# EasyEDA Pro project FM解调rda5807.eprj

# Schematic Schematic1
Board Name: Board1; Create Date: 2025-06-25; Page Name: P1; Project Name: NE564FM解调; Schematic Name: Schematic1; Update Date: 2025-07-04; Company: 嘉立创EDA; Page Size: A4; Version: V1.0
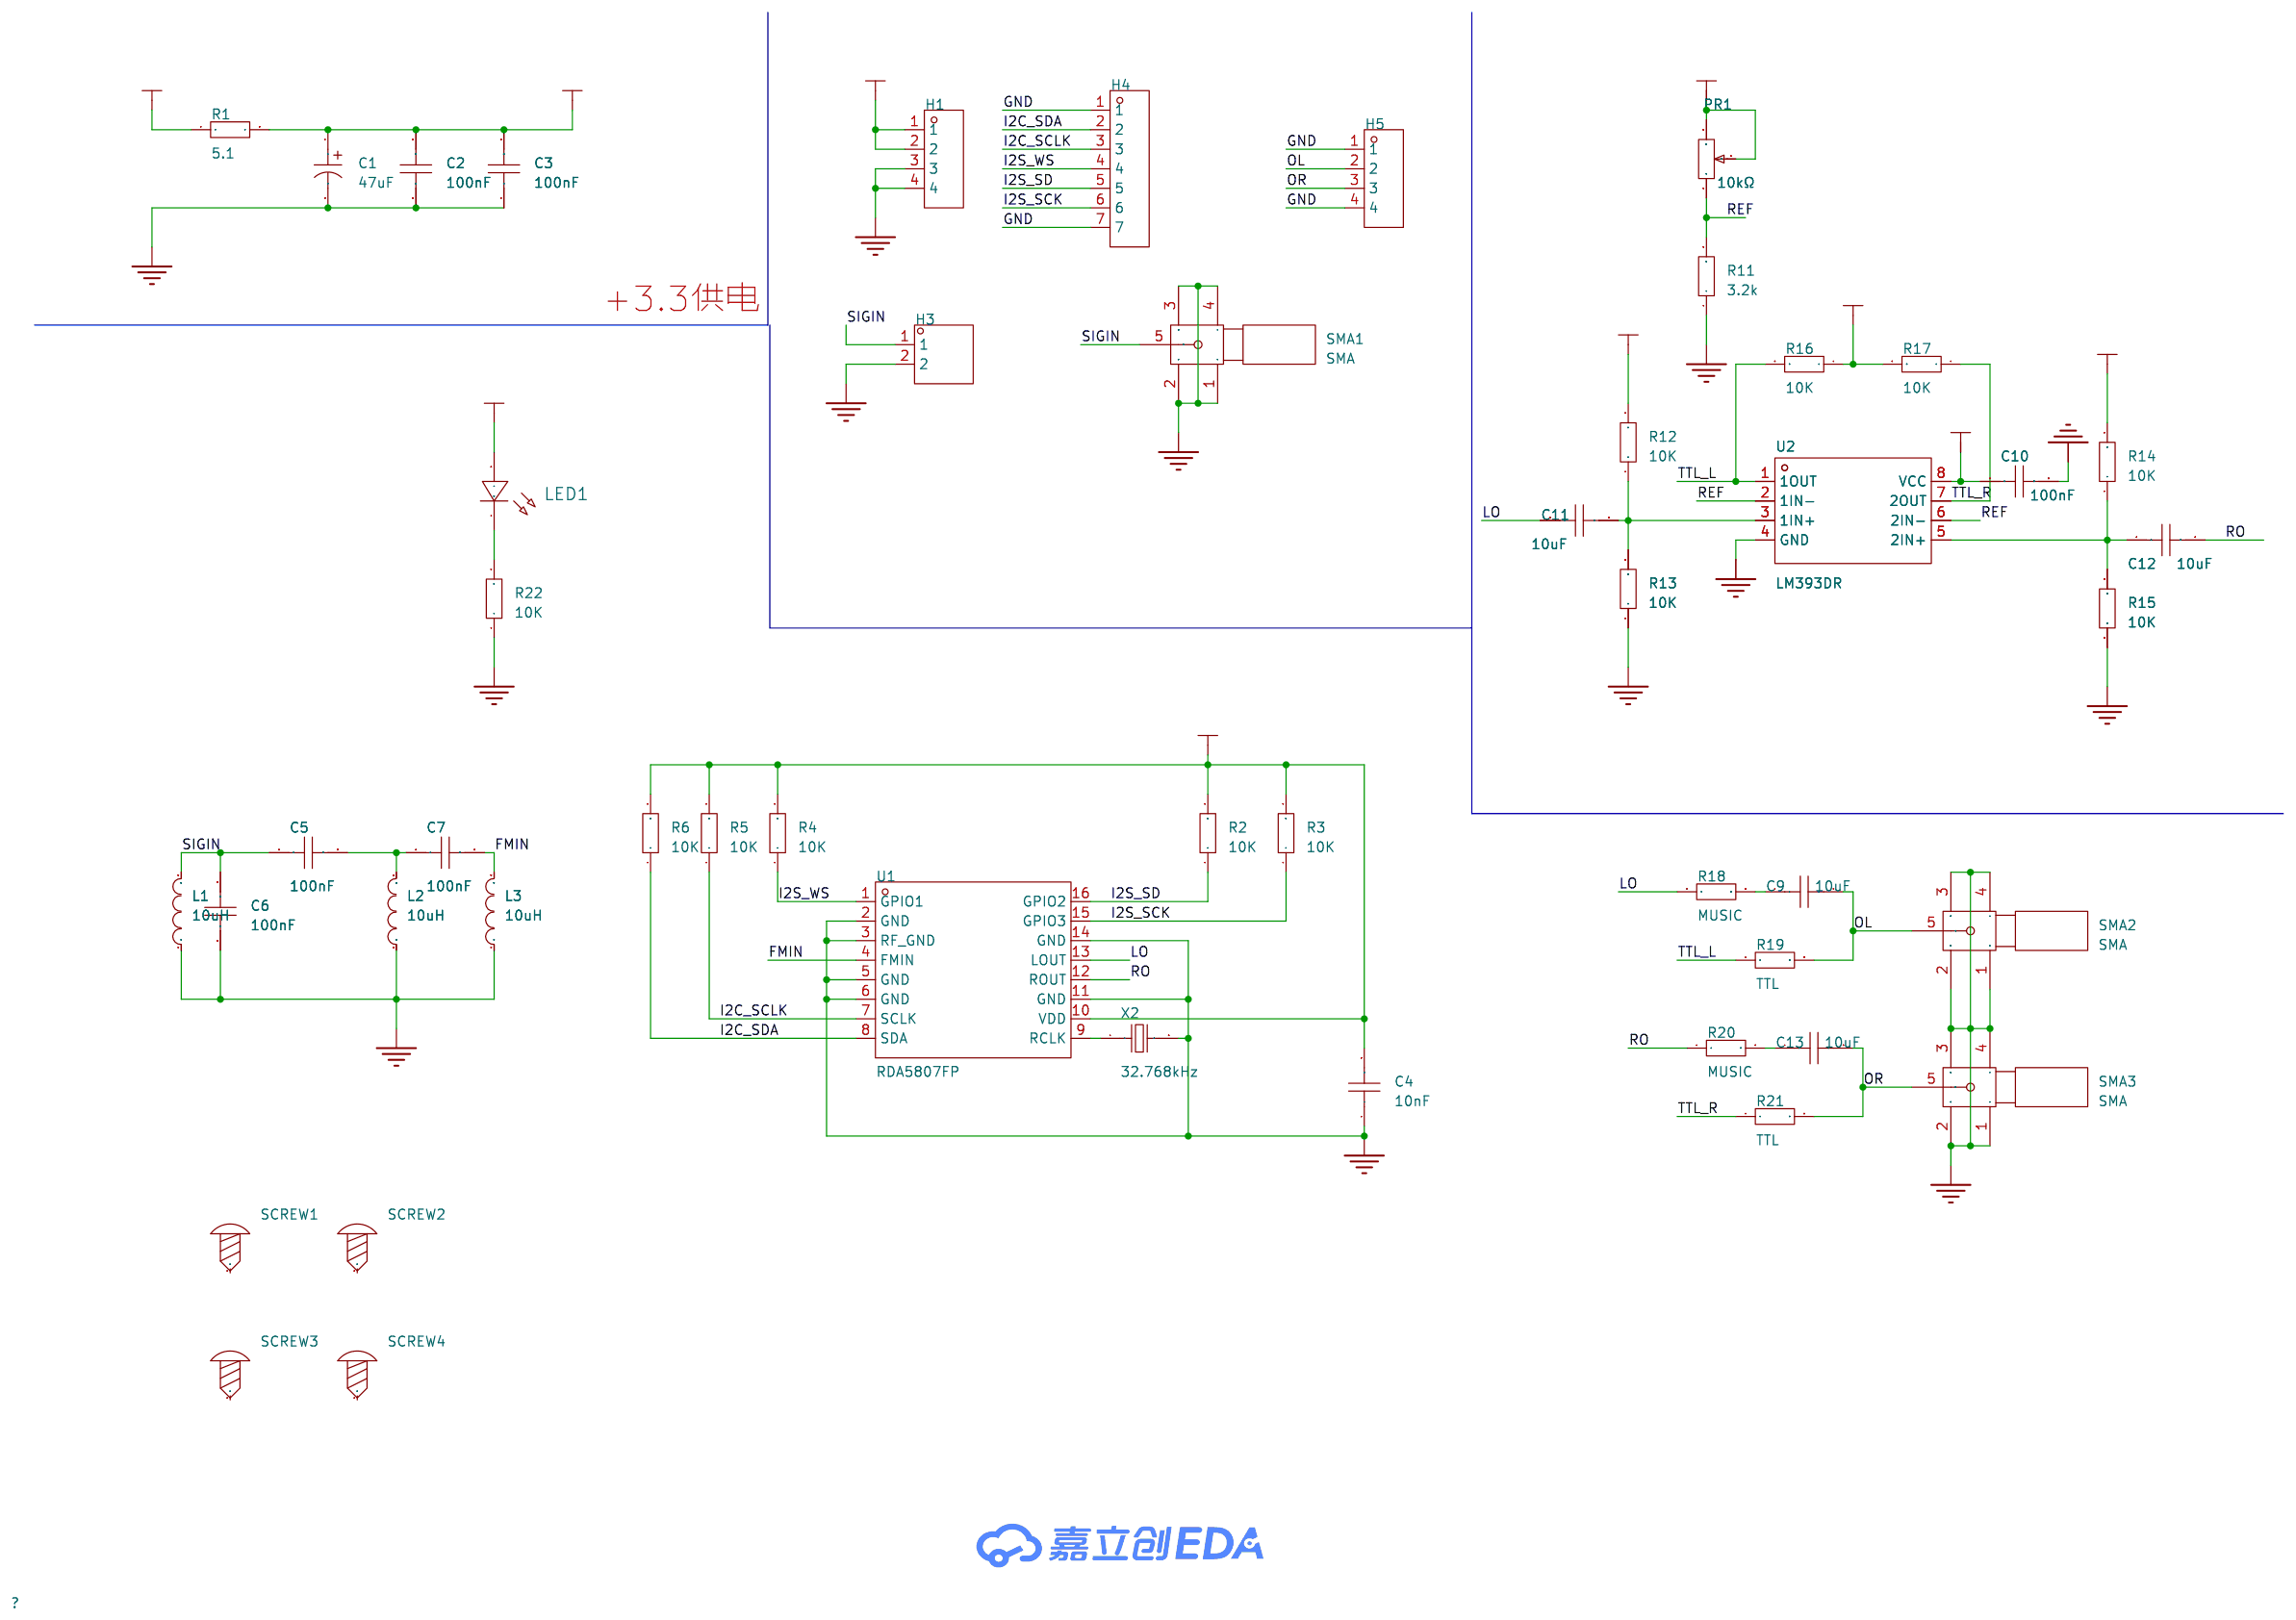
[diagram p0: schematic sheet]

## Parts
C1  47uF  [CAP-TH_BD6.3-P2.50-D0.5-FD]
C2  100nF  [C0603]
C3  100nF  [C0603]
C4  10nF  [C0603]
C5  100nF  [C0603]
C6  100nF  [C0603]
C7  100nF  [C0603]
C9  10uF  [C0603]
C10  100nF  [C0603]
C11  10uF  [C0603]
C12  10uF  [C0603]
C13  10uF  [C0603]
H1  -  [HDR-TH_4P-P2.54-V-M]
H3  -  [HDR-TH_2P-P2.54-V-M-1]
H4  -  [HDR-TH_7P-P2.54-V-M]
H5  -  [HDR-TH_4P-P2.54-V-M]
L1  10uH  [L0603]
L2  10uH  [L0603]
L3  10uH  [L0603]
LED1  -  [LED_0603]
PR1  10kΩ  [R_3296]
R1  5.1  [R0603]
R2  10K  [R0603]
R3  10K  [R0603]
R4  10K  [R0603]
R5  10K  [R0603]
R6  10K  [R0603]
R11  3.2k  [R0603]
R12  10K  [R0603]
R13  10K  [R0603]
R14  10K  [R0603]
R15  10K  [R0603]
R16  10K  [R0603]
R17  10K  [R0603]
R18  MUSIC  [R0603]
R19  TTL  [R0603]
R20  MUSIC  [R0603]
R21  TTL  [R0603]
R22  10K  [R0603]
SCREW1  -  [M2螺丝]
SCREW2  -  [M2螺丝]
SCREW3  -  [M2螺丝]
SCREW4  -  [M2螺丝]
SMA1  SMA  [SMA-SMD_BWSMA-KE-P001]
SMA2  SMA  [SMA-SMD_BWSMA-KE-P001]
SMA3  SMA  [SMA-SMD_BWSMA-KE-P001]
U1  RDA5807FP  [SOP-16_L10.0-W3.9-P1.27-LS6.0-BL]
U2  LM393DR  [SOIC-8_L5.0-W4.0-P1.27-LS6.0-BL]
X2  32.768kHz  [FC-135R_L3.2-W1.5]

## Library data of the parts
C1 = CD26G1HM470E120T: 容值:47uF;精度:±20%;额定电压:50V;纹波电流:234mA@100kHz;等效串联电阻(ESR):710mΩ@100kHz;; LCSC Part Name: 长寿命耐高纹波耐高温，5000H-80000H at 105℃ 47uF ±20% 50V; Supplier Part: C42460502; Manufacturer: 创慧电子; Supplier Footprint: 插件,D6.3xL12mm; Datasheet: https://atta.szlcsc.com/upload/public/pdf/source/20250208/95E25F66E0D5629BBC6A4318C6E986E6.pdf; Supplier: LCSC; Tolerance: ±20%; Voltage Rating: 50V; Ripple Current: 234mA@100kHz; Equivalent Series Resistance(ESR): 710mΩ@100kHz; Pin Spacing: 2.5mm; Diameter: 6.3mm; Height - Seated (Max): 12mm; Lifetime: 8000hrs@105℃; Operating Temperature: -40℃~+105℃
C2-C7 C9-C13 = CAP_0603: Supplier Footprint: 0603
H1 H5 = HDR-M_2.54_1x4P: Supplier Part: C492403; Supplier Footprint: 插件
H3 = HDR-M_2.54_1x2P: Supplier Part: C124375; Supplier Footprint: 插件
H4 = HDR-M_2.54_1x7P: Supplier Part: C492406; Supplier Footprint: 插件
L1-L3 = L_0603
LED1 = LED_0603-R: Supplier Footprint: 0603
PR1 = R_3296: Supplier Footprint: 直插
R1-R6 R11-R22 = Res_0603: Supplier Footprint: 0603
SCREW1-SCREW4 = M2螺丝: Supplier Footprint: 插件
SMA1-SMA3 = SMA: Supplier Part: C9900018296; JLCPCB Part Class: 扩展库; Supplier: LCSC
U1 = RDA5807FP: Supplier Part: C77689; Manufacturer: RDA(锐迪科); Supplier Footprint: SOP-16; JLCPCB Part Class: 扩展库; Datasheet: https://atta.szlcsc.com/upload/public/pdf/source/20180224/C77689_15194370344091364066.pdf; Supplier: LCSC
U2 = LM393DR: 比较器数:双路;输入失调电压(Vos):2mV;输入偏置电流(Ib):25nA;; Supplier Part: C67470; Manufacturer: TI(德州仪器); Supplier Footprint: SOIC-8; JLCPCB Part Class: 扩展库; Datasheet: https://www.ti.com/cn/lit/gpn/lm393; Supplier: LCSC; Number of Channels: 双路; Vos - Input Offset Voltage: 2mV; Ib - Input Bias Current: 25nA; Propagation Delay Time: 1.3us; Voltage - Supply: 2V~36V; Output Type: TTL；CMOS; Quiescent Current per Amplifier: 400uA; Operating Temperature: 0℃~+70℃
X2 = Q13FC13500004_C32346: 晶振类型:贴片晶振;频率:32.768kHz;常温频差:±20ppm;负载电容:12.5pF;; LCSC Part Name: 32.768kHz ±20ppm 12.5pF; Supplier Part: C32346; Manufacturer: EPSON(爱普生); Manufacturer Part: Q13FC13500004; Supplier Footprint: SMD3215-2P; JLCPCB Part Class: 基础库; Datasheet: https://atta.szlcsc.com/upload/public/pdf/source/20240418/0E0FF5F0356BA3753F616001439D1416.pdf; Supplier: LCSC; Crystal Type: 贴片晶振; Normal temperature Frequency Tolerance: ±20ppm; Load Capacitor: 12.5pF; Equivalent Series Resistance (ESR): 70kΩ; Operating Temperature: -40℃~+85℃

## Nets
+3.3V: C1.1 C2.2 C3.2 C4.2 C10.1 LED1.2(A) PR1.2 PR1.3 R1.2 R2.2 R3.2 R4.2 R5.2 R6.2 R12.2 R14.2 R16.1 R17.2 U1.10(VDD) U2.8(VCC)
GND: C1.2 C2.1 C3.1 C4.1 C6.1 C10.2 H1.3 H1.4 H3.2 H4.1 H4.7 H5.1 H5.4 L1.1 L2.1 L3.1 R11.1 R13.1 R15.1 R22.1 SMA1.1 SMA1.2 SMA1.3 SMA1.4 SMA2.1 SMA2.2 SMA2.3 SMA2.4 SMA3.1 SMA3.2 SMA3.3 SMA3.4 U1.2(GND) U1.3(RF GND) U1.5(GND) U1.6(GND) U1.11(GND) U1.14(GND) U2.4(GND) X2.2
VBUS: H1.1 H1.2 R1.1
FMIN: C7.2 L3.2 U1.4(FMIN)
I2C_SCLK: H4.3 R5.1 U1.7(SCLK)
I2C_SDA: H4.2 R6.1 U1.8(SDA)
I2S_SCK: H4.6 R3.1 U1.15(GPIO3)
I2S_SD: H4.5 R2.1 U1.16(GPIO2)
I2S_WS: H4.4 R4.1 U1.1(GPIO1)
LO: C11.1 R18.1 U1.13(LOUT)
OL: C9.2 H5.2 R19.2 SMA2.5
OR: C13.2 H5.3 R21.2 SMA3.5
REF: PR1.1 R11.2 U2.2(1IN-) U2.6(2IN-)
RO: C12.2 R20.1 U1.12(ROUT)
SIGIN: C5.1 C6.2 H3.1 L1.2 SMA1.5
TTL_L: R16.2 R19.1 U2.1(1OUT)
TTL_R: R17.1 R21.1 U2.7(2OUT)
$1N1908: C5.2 C7.1 L2.2
$1N3683: C11.2 R12.1 R13.2 U2.3(1IN+)
$1N4234: C12.1 R14.1 R15.2 U2.5(2IN+)
$1N4731: LED1.1(C) R22.2
$1N6553: U1.9(RCLK) X2.1
$1N7456: C9.1 R18.2
$1N7502: C13.1 R20.2

Not connected (* = marked no-connect by the designer): SCREW1 1; SCREW2 1; SCREW3 1; SCREW4 1

## Notes on the sheet
- +3.3供电

# Board PCB1
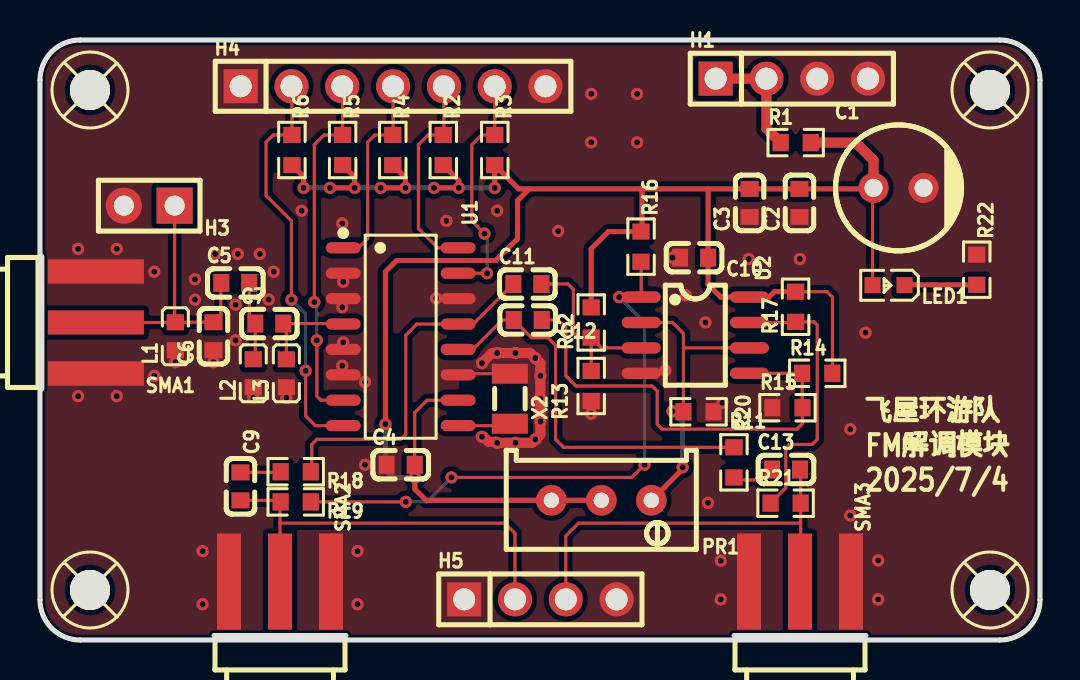
[diagram p1: board, top side]
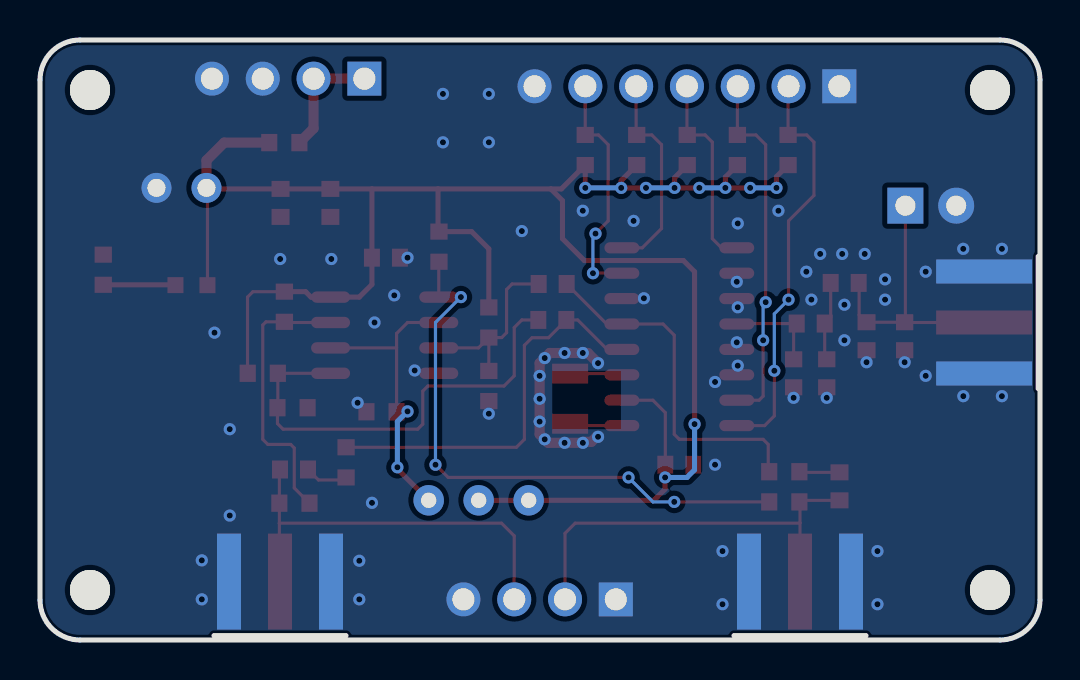
[diagram p2: board, bottom side, seen from below]

Outline 50 x 30 mm; copper layers: Top Layer, Bottom Layer. Coordinates in mm from the lower left corner of the outline.
Outline path: 0,28 0,2 arc(0.59,0.59) 2,0 48,0 arc(49.41,0.59) 50,2 50,28 arc(49.41,29.41) 48,30 2,30 arc(0.59,29.41) 0,28
Stack: Top Layer 0.035mm / Dielectric1 1.51mm FR4 er 4.5 / Bottom Layer 0.035mm

## Design rules (mm)
template: 自定义配置
spacing copperThickness1oz (default): track to track 0.102, other pairs 0.152 to 0.3
spacing copperThickness2oz: track to track 0.203, other pairs 0.152 to 0.3
track width copperThickness1oz (default): min 0.127, default 0.254, max 2.54
track width copperThickness2oz: min 0.203, default 0.254, max 2.54
differential pair differentialPair (default): width min 0.127, default 0.254, max 2.54; gap min 0.152, default 0.152
via viaSize (default): diameter min 0.5, default 0.61, max 10; hole min 0.3, default 0.305, max 6.3
pour e482 uses main
pour e681 uses main

## Placement (name value [footprint] x y rotation side)
C1  47uF  [CAP-TH_BD6.3-P2.50-D0.5-FD]  42.93 22.61 0 top
C2  100nF  [C0603]  37.97 21.85 90 top
C3  100nF  [C0603]  35.48 21.85 90 top
C4  10nF  [C0603]  18.03 8.76 0 top
C5  100nF  [C0603]  9.77 17.85 0 top
C6  100nF  [C0603]  8.67 15.19 90 top
C7  100nF  [C0603]  11.47 15.82 0 top
C9  10uF  [C0603]  10.03 7.68 270 top
C10  100nF  [C0603]  32.7 19.12 180 top
C11  10uF  [C0603]  24.37 17.8 0 top
C12  10uF  [C0603]  24.38 16 180 top
C13  10uF  [C0603]  37.3 8.53 0 top
H1  -  [HDR-TH_4P-P2.54-V-M]  37.59 28.07 0 top
H3  -  [HDR-TH_2P-P2.54-V-M-1]  5.46 21.72 180 top
H4  -  [HDR-TH_7P-P2.54-V-M]  17.65 27.69 0 top
H5  -  [HDR-TH_4P-P2.54-V-M]  25.02 2.03 0 top
L1  10uH  [L0603]  6.77 15.19 90 top
L2  10uH  [L0603]  10.66 13.34 90 top
L3  10uH  [L0603]  12.32 13.33 90 top
LED1  -  [LED_0603]  42.38 17.73 180 top
PR1  10kΩ  [R_3296]  28.07 6.86 180 top
R1  5.1  [R0603]  37.78 24.87 0 top
R2  10K  [R0603]  20.16 24.5 270 top
R3  10K  [R0603]  22.74 24.5 270 top
R4  10K  [R0603]  17.64 24.5 270 top
R5  10K  [R0603]  15.13 24.5 270 top
R6  10K  [R0603]  12.6 24.5 270 top
R11  3.2k  [R0603]  32.93 11.41 180 top
R12  10K  [R0603]  27.56 15.88 90 top
R13  10K  [R0603]  27.56 12.7 90 top
R14  10K  [R0603]  38.86 13.33 0 top
R15  10K  [R0603]  37.37 11.61 0 top
R16  10K  [R0603]  30.05 19.67 270 top
R17  10K  [R0603]  37.78 16.66 90 top
R18  MUSIC  [R0603]  12.79 8.41 180 top
R19  TTL  [R0603]  12.79 6.91 180 top
R20  MUSIC  [R0603]  34.7 8.88 270 top
R21  TTL  [R0603]  37.28 6.84 0 top
R22  10K  [R0603]  46.84 18.51 270 top
SCREW1  -  [M2螺丝]  2.5 27.5 0 top
SCREW2  -  [M2螺丝]  47.5 27.5 0 top
SCREW3  -  [M2螺丝]  2.5 2.5 0 top
SCREW4  -  [M2螺丝]  47.5 2.5 0 top
SMA1  SMA  [SMA-SMD_BWSMA-KE-P001]  2.79 15.88 180 top
SMA2  SMA  [SMA-SMD_BWSMA-KE-P001]  12 2.92 270 top
SMA3  SMA  [SMA-SMD_BWSMA-KE-P001]  38 2.92 270 top
U1  RDA5807FP  [SOP-16_L10.0-W3.9-P1.27-LS6.0-BL]  18.03 15.16 270 top
U2  LM393DR  [SOIC-8_L5.0-W4.0-P1.27-LS6.0-BL]  32.77 15.24 270 top
X2  32.768kHz  [FC-135R_L3.2-W1.5]  23.5 12.06 90 top

## Footprints (pads in the part's own frame, mm; a bottom-side part is the same pattern mirrored in y, then rotated)
C0603
  rect 0.8x0.9 smd: 1(-0.7,0) 2(0.7,0)
CAP-TH_BD6.3-P2.50-D0.5-FD
  round 1.5 hole 0.9: 1(-1.25,0) 2(1.25,0)
FC-135R_L3.2-W1.5
  rect 1x1.8 smd: 1(-1.25,0) 2(1.25,0)
HDR-TH_2P-P2.54-V-M-1
  rect 1.8x1.8 hole 1: 1(-1.27,0)
  round 1.8 hole 1: 2(1.27,0)
HDR-TH_4P-P2.54-V-M
  rect 1.7x1.7 hole 1.1: 1(-3.81,0)
  round 1.7 hole 1.1: 2(-1.27,0) 3(1.27,0) 4(3.81,0)
HDR-TH_7P-P2.54-V-M
  rect 1.7x1.7 hole 1.1: 1(-7.62,0)
  round 1.7 hole 1.1: 2(-5.08,0) 3(-2.54,0) 4(0,0) 5(2.54,0) 6(5.08,0) 7(7.62,0)
L0603
  rect 0.8x0.864 smd: 1(-0.7,0) 2(0.7,0)
LED_0603
  rect 0.8x0.8 smd: 1(-0.851,-0.01) 2(0.75,-0.005)
M2螺丝
  round 2 hole 2: 1(0,0)
R0603
  rect 0.806x0.864 smd: 1(-0.753,0) 2(0.753,0)
R_3296
  round 1.524 hole 0.762: 1(-2.499,-0.127) 2(0,-0.127) 3(2.499,-0.127)
SMA-SMD_BWSMA-KE-P001
  rect 4.8x1.2 smd: 1(0,-2.55) 2(0,2.55) 5(0,0)
  rect 4.8x1.2 smd far side: 3(0,2.55) 4(0,-2.55)
SOIC-8_L5.0-W4.0-P1.27-LS6.0-BL
  oval 0.569x1.95 smd: 1(-1.905,-2.705) 2(-0.635,-2.705) 3(0.635,-2.705) 4(1.905,-2.705) 5(1.905,2.705) 6(0.635,2.705) 7(-0.635,2.705) 8(-1.905,2.705)
SOP-16_L10.0-W3.9-P1.27-LS6.0-BL
  oval 0.56x1.745 smd: 1(-4.445,-2.873) 2(-3.175,-2.873) 3(-1.905,-2.873) 4(-0.635,-2.873) 5(0.635,-2.873) 6(1.905,-2.873) 7(3.175,-2.873) 8(4.445,-2.873) 9(4.445,2.873) 10(3.175,2.873) 11(1.905,2.873) 12(0.635,2.873) 13(-0.635,2.873) 14(-1.905,2.873) 15(-3.175,2.873) 16(-4.445,2.873)

## Nets
As in the schematic.

Pads without a net: SCREW1 1; SCREW2 1; SCREW3 1; SCREW4 1

## Via types
v1: diameter 0.61, hole 0.305, Top Layer to Bottom Layer, 88 vias

## Routing (per net, layer and track width the routed paths; a pad name or vN(x,y) marks a point on that pad's centre or on a via; arc(x,y) is an arc through that point)
+3.3V: length 105.4
  Top Layer w0.158: R14.2 39.62,13.34 39.62,17.14 39.35,17.42 R17.2 ; U1.10 19.35,11.99 18.73,11.37 C4.2 ; 41.63,17.74 41.63,22.56
  Top Layer w0.254: 33.4,22.55 C3.2 C2.2 41.62,22.55 C1.1 ; 33.4,22.55 C10.1 33.4,17.78 34.04,17.14 U2.8 36.45,17.14 36.72,17.42 R17.2 ; 33.4,22.55 30.1,22.55 ; R5.2 15.73,23.14 v1(15.73,22.61) v1(14.49,22.61) ; 30.1,22.55 30.1,20.47 R16.1 28.42,20.42 27.56,19.56 R12.2 ; 30.1,22.55 24.46,22.55 ; v1(17.03,22.61) v1(18.27,22.61) 18.27,23.11 R4.2 ; v1(18.75,8.13) 18.75,7.54 19.3,6.98 PR1.3 PR1.2 ; v1(13.18,22.61) 13.18,23.17 R6.2 ; v1(17.27,10.8) 17.27,18.42 17.83,18.97 22.78,18.97 23.88,20.07 23.88,21.97 24.46,22.55 ; v1(22.74,22.61) 22.74,22.61 R3.2 23.93,22.55 24.46,22.55 ; v1(19.7,22.61) v1(20.94,22.61) 20.94,22.97 R2.2
  Top Layer w0.508: C1.1 41.68,23.98 40.79,24.87 R1.2
  Bottom Layer w0.254: v1(14.49,22.61) 13.18,22.61 ; v1(18.75,8.13) 17.65,8.13 17.27,8.51 v1(17.27,10.8) ; v1(22.74,22.61) v1(20.94,22.61) ; v1(17.03,22.61) v1(15.73,22.61) ; v1(19.7,22.61) v1(18.27,22.61)
GND: length 12.7
  Top Layer w0.158: X2.2 20.96,13.31 U1.11
  Top Layer w0.508: v1(22.1,10.16) 22.18,10.16 22.43,9.91 22.81,9.91 v1(22.86,9.86) v1(23.77,9.86) 24.59,9.86 v1(24.76,10.03) 25.02,10.29 v1(25.02,10.92) v1(25.02,12.06) v1(25.02,13.21) 25.02,13.84 v1(24.76,14.1) 24.51,14.35 v1(23.77,14.35) v1(22.86,14.35) 22.61,14.35 v1(22.1,13.84)
  vias: v1(1.91,19.56) v1(1.91,12.19) v1(3.84,19.56) v1(3.83,12.19) v1(5.72,18.42) v1(5.72,13.21) v1(6.77,13.89) v1(7.75,18.03) v1(7.75,17.02) v1(8.13,4.44) v1(8.13,1.79) v1(8.67,13.89) v1(8.76,19.3) v1(9.78,16.76) v1(9.78,14.99) v1(9.89,19.3) v1(10.66,12.11) v1(10.99,19.3) v1(11.43,17.02) v1(11.68,18.42) v1(12.32,12.11) v1(13.08,21.46) v1(15.11,20.83) v1(15.11,16.64) v1(15.11,13.72) v1(15.16,17.91) v1(15.16,14.88) v1(15.88,4.44) v1(15.88,1.79) v1(16.25,12.9) v1(16.25,8.76) v1(19.81,17.09) v1(20.32,20.95) v1(22.86,21.46) v1(25.91,20.45) v1(27.56,27.31) v1(27.56,24.88) v1(27.56,11.31) v1(29.85,27.31) v1(29.85,24.88) v1(31.27,13.48) v1(31.62,19.12) v1(32.29,17.23) v1(33.27,15.88) v1(33.4,6.86) v1(34.04,3.96) v1(34.04,2.03) v1(34.12,11.86) v1(35.43,19.05) v1(37.99,19.05) v1(40.51,10.54) v1(40.51,6.22) v1(41.28,15.37) v1(41.91,3.98) v1(41.91,2.03)
VBUS: length 6
  Top Layer w0.508: R1.1 36.32,25.58 H1.2 H1.1
FMIN: length 4.9
  Top Layer w0.158: L3.2 12.32,15.67 C7.2 15.14,15.82 U1.4
I2C_SCLK: length 18.1
  Top Layer w0.158: U1.7 14.05,11.99 13.84,12.19 v1(13.84,14.99) ; v1(13.72,16.89) 13.72,24.77 14.2,25.25 R5.1 15.13,27.67 H4.3
  Bottom Layer w0.158: v1(13.72,16.89) 13.84,16.76 v1(13.84,14.99)
I2C_SDA: length 20.5
  Top Layer w0.158: v1(12.57,17.02) 12.57,20.95 11.3,22.22 11.3,24.89 11.66,25.25 R6.1 12.6,27.66 H4.2 ; U1.8 13.77,10.72 13.28,11.2 v1(13.28,13.46)
  Bottom Layer w0.158: v1(13.28,13.46) 13.28,16.31 v1(12.57,17.02)
I2S_SCK: length 12
  Top Layer w0.158: U1.15 v1(22.35,18.34) ; v1(22.22,20.32) 21.59,20.95 21.59,24.77 22.08,25.25 R3.1 22.74,27.68 H4.6
  Bottom Layer w0.158: v1(22.35,18.34) 22.35,20.19 v1(22.22,20.32)
I2S_SD: length 10.5
  Top Layer w0.158: H4.5 20.19,25.28 R2.1 19.41,25.25 18.92,24.77 18.92,20.57 19.89,19.61 20.91,19.61
I2S_WS: length 10.1
  Top Layer w0.158: 15.16,19.61 15.93,19.61 16.38,20.07 16.38,24.89 16.74,25.25 R4.1 17.65,25.27 H4.4
LO: length 17.7
  Top Layer w0.158: R18.1 13.59,8.46 13.59,9.78 13.84,10.03 18.03,10.03 18.29,10.29 18.29,15.24 18.85,15.8 U1.13 21.67,15.8 C11.1
OL: length 21.3
  Top Layer w0.158: 12,5.86 12,6.87 R19.2 11.96,6.98 C9.2 ; 12,5.86 SMA2.5 ; 12,5.86 12.01,5.84 23.24,5.84 23.75,5.33 H5.2
OR: length 20.8
  Top Layer w0.158: 38.03,5.84 38.03,2.95 SMA3.5 ; 38.03,5.84 38.03,8.49 C13.2 ; 38.03,5.84 38.03,5.84 26.92,5.84 26.29,5.21 26.29,2.03
REF: length 14.9
  Top Layer w0.158: U2.2 31.62,15.88 32.17,15.33 32.17,14.61 ; 32.17,14.61 32.18,14.61 U2.6 ; 32.17,14.61 R11.2
  Top Layer w0.254: v1(32.13,8.64) 32.13,8.55 PR1.1
  Bottom Layer w0.254: v1(31.62,11.43) 32.13,10.92 v1(32.13,8.64)
RO: length 19.8
  Top Layer w0.158: 34.7,9.63 26.18,9.63 25.78,10.03 25.78,14.73 25.4,15.11 24.57,15.11 C12.2 23.11,16 21.64,14.53 U1.12
SIGIN: length 13.9
  Top Layer w0.158: C5.1 9.04,17.83 9.04,16.26 C6.2 L1.2 ; L1.2 6.75,15.88 SMA1.5 ; L1.2 6.73,15.92 H3.1
TTL_L: length 28.1
  Top Layer w0.158: R19.1 v1(18.29,6.91) ; U2.1 30.06,18.9 R16.2 ; v1(20.57,8.13) 29.59,8.13 v1(30.23,8.76)
  Bottom Layer w0.158: v1(28.96,17.14) 30.23,15.88 v1(30.23,8.76) ; v1(20.57,8.13) 19.35,6.91 v1(18.29,6.91)
TTL_R: length 14
  Top Layer w0.158: U2.7 37.75,15.88 R17.1 38.7,15.91 38.86,15.75 38.86,10.03 38.61,9.78 37.47,9.78 37.29,9.6 37.29,7.6 R21.1
$1N1908: length 4
  Top Layer w0.158: C5.2 10.47,16.12 10.76,15.82 10.76,14.14 L2.2
$1N3683: length 9.2
  Top Layer w0.158: R12.1 28.08,14.61 U2.3 ; R12.1 R13.2 ; R12.1 26.92,15.12 26.67,15.37 26.67,17.53 26.4,17.8 C11.2
$1N4234: length 23
  Top Layer w0.158: U2.5 R14.1 38.11,11.63 R15.2 38.13,10.82 37.85,10.54 31.12,10.54 30.86,10.8 30.86,12.45 30.61,12.7 26.8,12.7 26.29,13.21 26.29,15.62 25.91,16 C12.1
$1N4731: length 3.6
  Top Layer w0.254: LED1.1 43.24,17.76 R22.2
$1N6553: length 2.6
  Top Layer w0.158: X2.1 23.4,10.72 U1.9
$1N7456: length 2
  Top Layer w0.158: C9.1 12,8.38 R18.2
$1N7502: length 2.2
  Top Layer w0.158: C13.1 36.08,8 34.82,8 R20.2

## Copper pours and planes (outline as drawn; the poured copper is in the pictures)
GND on Top Layer: -1.4,31.37 51.18,31.37 51.18,-1.52 -1.4,-1.52
GND on Bottom Layer: -0.76,30.86 50.67,30.86 50.67,-0.64 -0.76,-0.64

## Text on the board
Top Silkscreen Layer: 飞屋环游队 / FM解调模块 / 2025/7/4
